# EAGLE schematic Charging (EAGLE 9.3.0)
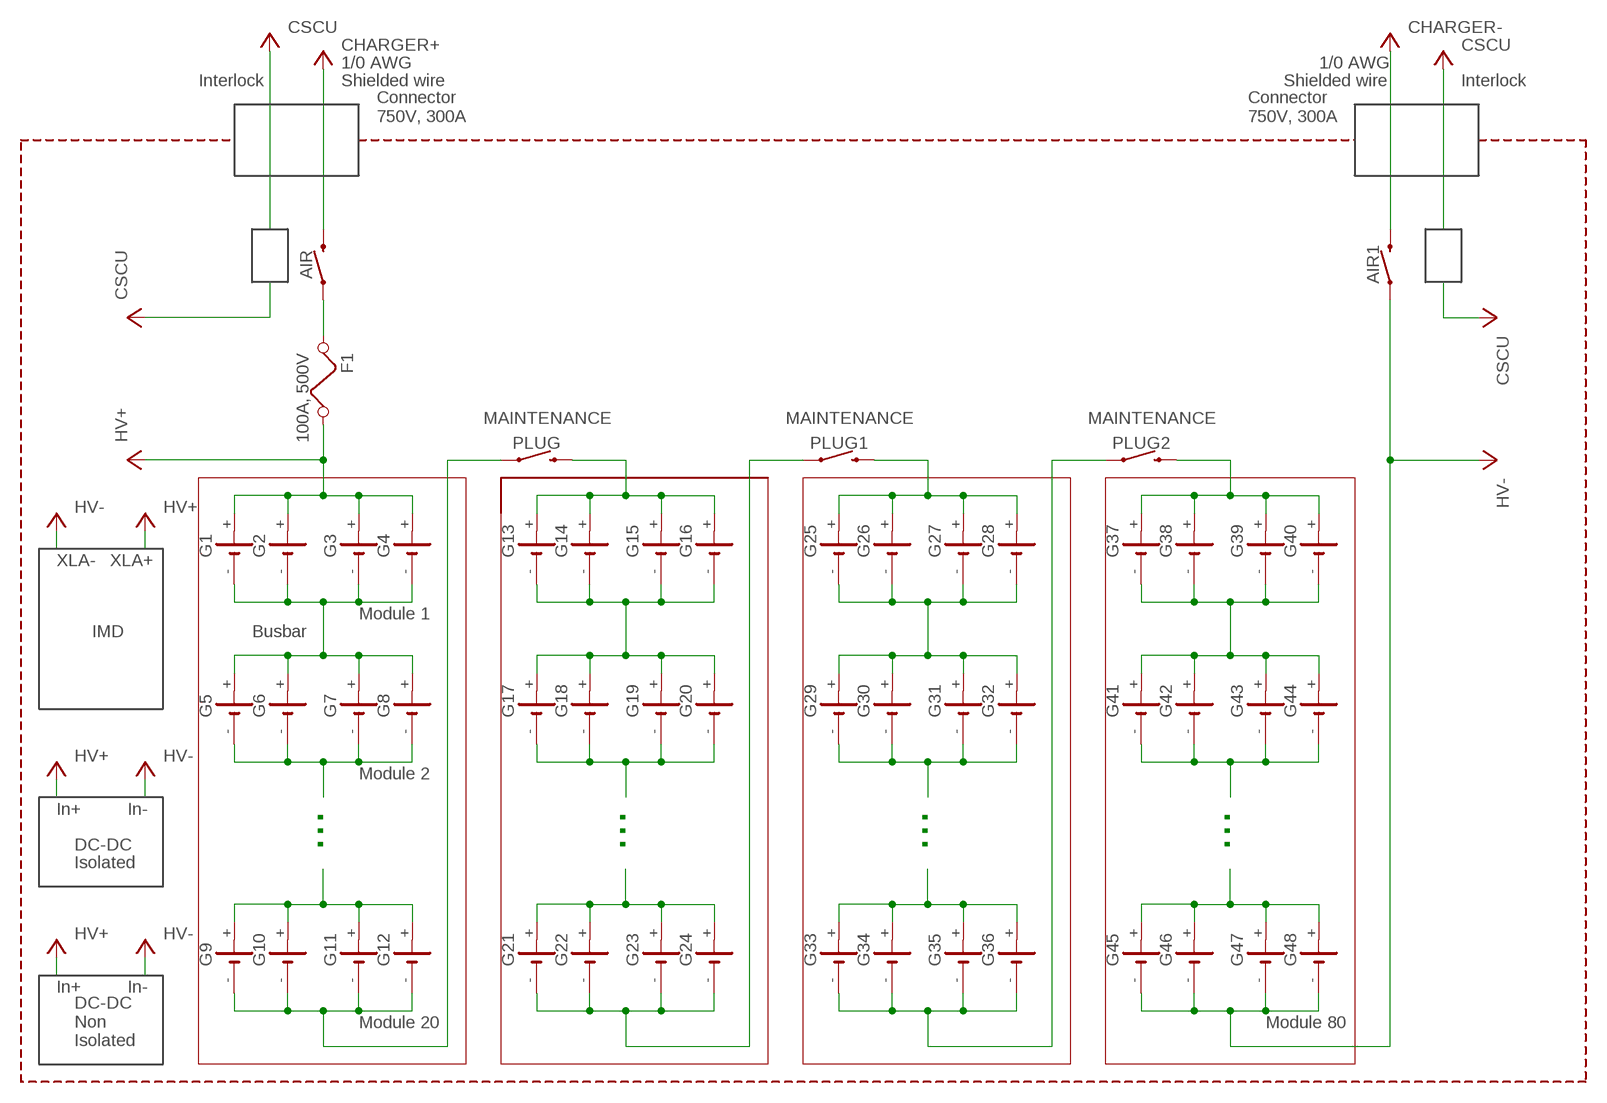
[diagram p0: schematic, sheet 1]

## Parts
AIR  MOMENTARY-SWITCH-SPST-PTH-6.0MM  [TACTILE_SWITCH_PTH_6.0MM]
AIR1  MOMENTARY-SWITCH-SPST-PTH-6.0MM  [TACTILE_SWITCH_PTH_6.0MM]
F1  100A, 500V  FUSE  [FUSE]
G1  SL-160AA/PR  [SL-160AA/PR]
G2  SL-160AA/PR  [SL-160AA/PR]
G3  SL-160AA/PR  [SL-160AA/PR]
G4  SL-160AA/PR  [SL-160AA/PR]
G5  SL-160AA/PR  [SL-160AA/PR]
G6  SL-160AA/PR  [SL-160AA/PR]
G7  SL-160AA/PR  [SL-160AA/PR]
G8  SL-160AA/PR  [SL-160AA/PR]
G9  SL-160AA/PR  [SL-160AA/PR]
G10  SL-160AA/PR  [SL-160AA/PR]
G11  SL-160AA/PR  [SL-160AA/PR]
G12  SL-160AA/PR  [SL-160AA/PR]
G13  SL-160AA/PR  [SL-160AA/PR]
G14  SL-160AA/PR  [SL-160AA/PR]
G15  SL-160AA/PR  [SL-160AA/PR]
G16  SL-160AA/PR  [SL-160AA/PR]
G17  SL-160AA/PR  [SL-160AA/PR]
G18  SL-160AA/PR  [SL-160AA/PR]
G19  SL-160AA/PR  [SL-160AA/PR]
G20  SL-160AA/PR  [SL-160AA/PR]
G21  SL-160AA/PR  [SL-160AA/PR]
G22  SL-160AA/PR  [SL-160AA/PR]
G23  SL-160AA/PR  [SL-160AA/PR]
G24  SL-160AA/PR  [SL-160AA/PR]
G25  SL-160AA/PR  [SL-160AA/PR]
G26  SL-160AA/PR  [SL-160AA/PR]
G27  SL-160AA/PR  [SL-160AA/PR]
G28  SL-160AA/PR  [SL-160AA/PR]
G29  SL-160AA/PR  [SL-160AA/PR]
G30  SL-160AA/PR  [SL-160AA/PR]
G31  SL-160AA/PR  [SL-160AA/PR]
G32  SL-160AA/PR  [SL-160AA/PR]
G33  SL-160AA/PR  [SL-160AA/PR]
G34  SL-160AA/PR  [SL-160AA/PR]
G35  SL-160AA/PR  [SL-160AA/PR]
G36  SL-160AA/PR  [SL-160AA/PR]
G37  SL-160AA/PR  [SL-160AA/PR]
G38  SL-160AA/PR  [SL-160AA/PR]
G39  SL-160AA/PR  [SL-160AA/PR]
G40  SL-160AA/PR  [SL-160AA/PR]
G41  SL-160AA/PR  [SL-160AA/PR]
G42  SL-160AA/PR  [SL-160AA/PR]
G43  SL-160AA/PR  [SL-160AA/PR]
G44  SL-160AA/PR  [SL-160AA/PR]
G45  SL-160AA/PR  [SL-160AA/PR]
G46  SL-160AA/PR  [SL-160AA/PR]
G47  SL-160AA/PR  [SL-160AA/PR]
G48  SL-160AA/PR  [SL-160AA/PR]
PLUG  MOMENTARY-SWITCH-SPST-PTH-6.0MM  [TACTILE_SWITCH_PTH_6.0MM]
PLUG1  MOMENTARY-SWITCH-SPST-PTH-6.0MM  [TACTILE_SWITCH_PTH_6.0MM]
PLUG2  MOMENTARY-SWITCH-SPST-PTH-6.0MM  [TACTILE_SWITCH_PTH_6.0MM]

## Nets
+5V: AIR1.1 AIR1.3 AIR.3 F1.2 G1.+ G2.+ G3.+ G4.+ G45.- G46.- G47.- G48.- ; supply symbol labelled HV+, HV-, CSCU, CHARGER+, CHARGER-
N$3: AIR.1 F1.1
N$6: G1.- G2.- G3.- G4.- G5.+ G6.+ G7.+ G8.+
N$7: G9.+ G10.+ G11.+ G12.+
N$8: G5.- G6.- G7.- G8.-
N$9: G9.- G10.- G11.- G12.- PLUG.1
N$10: G13.+ G14.+ G15.+ G16.+ PLUG.3
N$11: G21.+ G22.+ G23.+ G24.+
N$12: G13.- G14.- G15.- G16.- G17.+ G18.+ G19.+ G20.+
N$13: G17.- G18.- G19.- G20.-
N$15: G21.- G22.- G23.- G24.- PLUG1.1
N$16: G25.+ G26.+ G27.+ G28.+ PLUG1.3
N$17: G25.- G26.- G27.- G28.- G29.+ G30.+ G31.+ G32.+
N$18: G29.- G30.- G31.- G32.-
N$19: G33.+ G34.+ G35.+ G36.+
N$21: G33.- G34.- G35.- G36.- PLUG2.1
N$22: G37.+ G38.+ G39.+ G40.+ PLUG2.3
N$23: G37.- G38.- G39.- G40.- G41.+ G42.+ G43.+ G44.+
N$24: G41.- G42.- G43.- G44.-
N$26: G45.+ G46.+ G47.+ G48.+

## Notes on the sheet
- 1/0 AWG | 1/0 AWG
- Interlock | Shielded wire | Shielded wire | Interlock
- Connector
  750V, 300A
- Connector
  750V, 300A
- MAINTENANCE | MAINTENANCE | MAINTENANCE
- XLA- | XLA+
- Module 1
- IMD | Busbar
- Module 2
- In+ | In-
- DC-DC | ... | ... | ... | ...
- Isolated
- In+ | In-
- Module 20 | Module 80
- DC-DC
  Non
  Isolated

## Library data of the parts
AIR AIR1 PLUG PLUG1 PLUG2 = SparkFun-Switches:MOMENTARY-SWITCH-SPST: Momentary Switch (Pushbutton) - SPST Normally-open (NO) SPST momentary switches (buttons, pushbuttons). Variants PTH-12MM - 12mm square, through-hole Momentary Pushbutton Switch - 12mm Square <https://www.sparkfun.com/products/9190> (COM-09190) PTH-6.0MM, PTH-6.0MM-KIT - 6.0mm square, through-hole Mini Pushbutton Switch <https://www.sparkfun.com/products/97> (COM-00097) KIT package intended for soldering kit's - only one side of pads' copper is exposed. PTH-RIGHT-ANGLE-KIT - Right-angle, through-hole Right Angle Tactile Button <https://www.sparkfun.com/products/10791> - Used on SparkFun BigTime Watch Kit <https://www.sparkfun.com/products/11734> SMD-12MM - 12mm square, surface-mount Tactile Button - SMD (12mm) <https://www.sparkfun.com/products/12993> (COM-12993) Used on SparkFun PicoBoard <https://www.sparkfun.com/products/11888> SMD-4.5MM - 4.5mm Square Trackball Switch Used on SparkFun Blackberry Trackballer Breakout <https://www.sparkfun.com/products/13169> SMD-4.6MMX2.8MM - 4.60mm x 2.80mm, surface mount Used on SparkFun SAMD21 Mini Breakout <https://www.sparkfun.com/products/13664> SMD-5.2MM, SMD-5.2-REDUNDANT - 5.2mm square, surface-mount Mini Pushbutton Switch - SMD <https://www.sparkfun.com/products/8720> (COM-08720) Used on Arduino Pro Mini <https://www.sparkfun.com/products/11114> REDUNDANT package connects both switch circuits together SMD-6.0X3.5MM - 6.0 x 3.5mm, surface mount Momentary Reset Switch SMD <https://www.sparkfun.com/products/8229> (COM-08229) SMD-6.2MM-TALL - 6.2mm square, surface mount Tactile Button - SMD (6mm) <https://www.sparkfun.com/products/12992> Used on SparkFun Digital Sandbox <https://www.sparkfun.com/products/12651> SMD-RIGHT-ANGLE - Right-angle, surface mount Used on SparkFun Block for Intel® Edison - Arduino <https://www.sparkfun.com/products/13036>; PROD_ID: SWCH-08441; SF_SKU: COM-00097
F1 = special:FUSE: FUSE 5 x 20 mm
G1-G48 = battery:SL-160AA/PR: LI BATTERY Sonnenschein